# Altium schematic sheet Integrated_Main_Driver_Board-02-Sensor Circuit-20230110.SchDoc
size A4
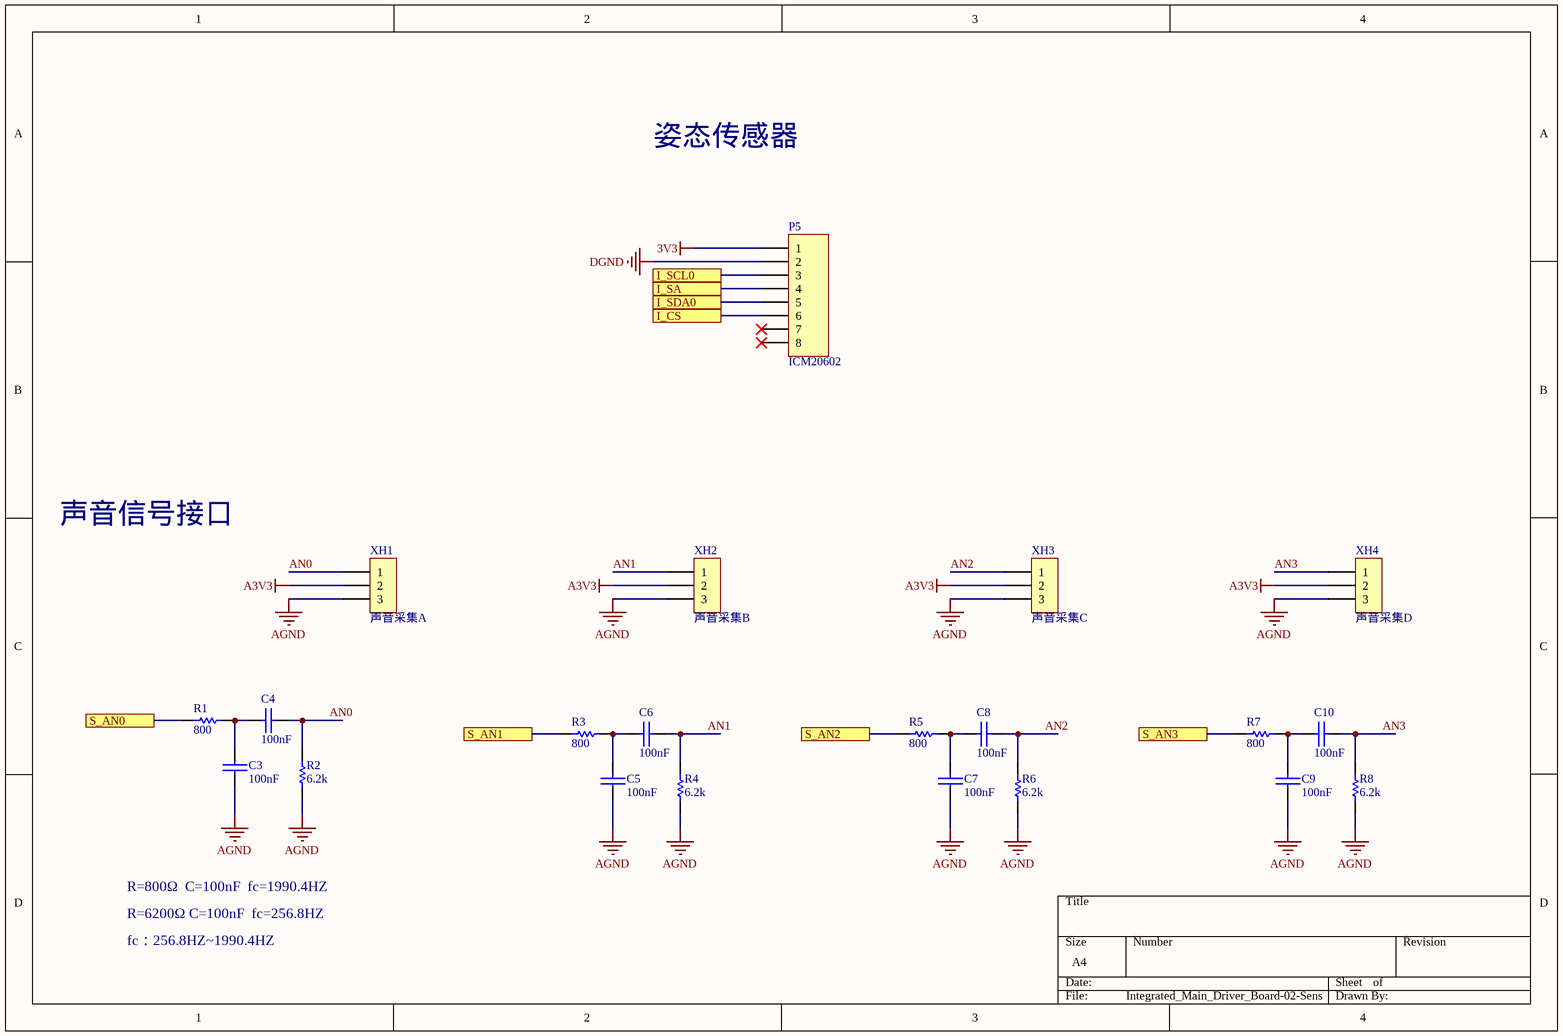
[diagram p0: Integrated_Main_Driver_Board-02-Sensor Circuit-20230110.SchDoc]

## Parts
C3  100nF  [0402C]
C4  100nF  [0402C]
C5  100nF  [0402C]
C6  100nF  [0402C]
C7  100nF  [0402C]
C8  100nF  [0402C]
C9  100nF  [0402C]
C10  100nF  [0402C]
P5  ICM20602  [HDR1X8]
R1  800  [0402R]
R2  6.2k  [0402R]
R3  800  [0402R]
R4  6.2k  [0402R]
R5  800  [0402R]
R6  6.2k  [0402R]
R7  800  [0402R]
R8  6.2k  [0402R]
XH1  声音采集A  [XH3/2.54mm/180]
XH2  声音采集B  [XH3/2.54mm/180]
XH3  声音采集C  [XH3/2.54mm/180]
XH4  声音采集D  [XH3/2.54mm/180]

## Ports
I_CS, I_SA, I_SCL0, I_SDA0, S_AN0, S_AN1, S_AN2, S_AN3

## Nets
3V3: P5.1
A3V3: XH1.2 XH2.2 XH3.2 XH4.2
AGND: C3.1 C5.1 C7.1 C9.1 R2.1 R4.1 R6.1 R8.1 XH1.3 XH2.3 XH3.3 XH4.3
DGND: P5.2
AN0: C4.1 R2.2 XH1.1
AN1: C6.1 R4.2 XH2.1
AN2: C8.1 R6.2 XH3.1
AN3: C10.1 R8.2 XH4.1
I_CS: P5.6 ; port I_CS
I_SA: P5.4 ; port I_SA
I_SCL0: P5.3 ; port I_SCL0
I_SDA0: P5.5 ; port I_SDA0
S_AN0: R1.1 ; port S_AN0
S_AN1: R3.1 ; port S_AN1
S_AN2: R5.1 ; port S_AN2
S_AN3: R7.1 ; port S_AN3
NetC3_2: C3.2 C4.2 R1.2
NetC5_2: C5.2 C6.2 R3.2
NetC7_2: C7.2 C8.2 R5.2
NetC9_2: C9.2 C10.2 R7.2

Not connected (* = marked no-connect by the designer): P5 7* 8*

## Notes on the sheet
- 姿态传感器
- 声音信号接口
- R=800Ω  C=100nF  fc=1990.4HZ
- R=6200Ω C=100nF  fc=256.8HZ
- fc：256.8HZ~1990.4HZ

## Library data of the parts
C3-C10 = CAP: 无极性电容
P5 = Header 8: Header, 8-Pin; LatestRevisionDate: 17-Jul-2002; LatestRevisionNote: Re-released for DXP Platform.; Publisher: Altium Limited
R1-R8 = RES
XH1-XH4 = XH3